# EAGLE schematic Arduino UNO R4 WIFI-Adavanced KIT V1.0 (EAGLE 9.5.1)
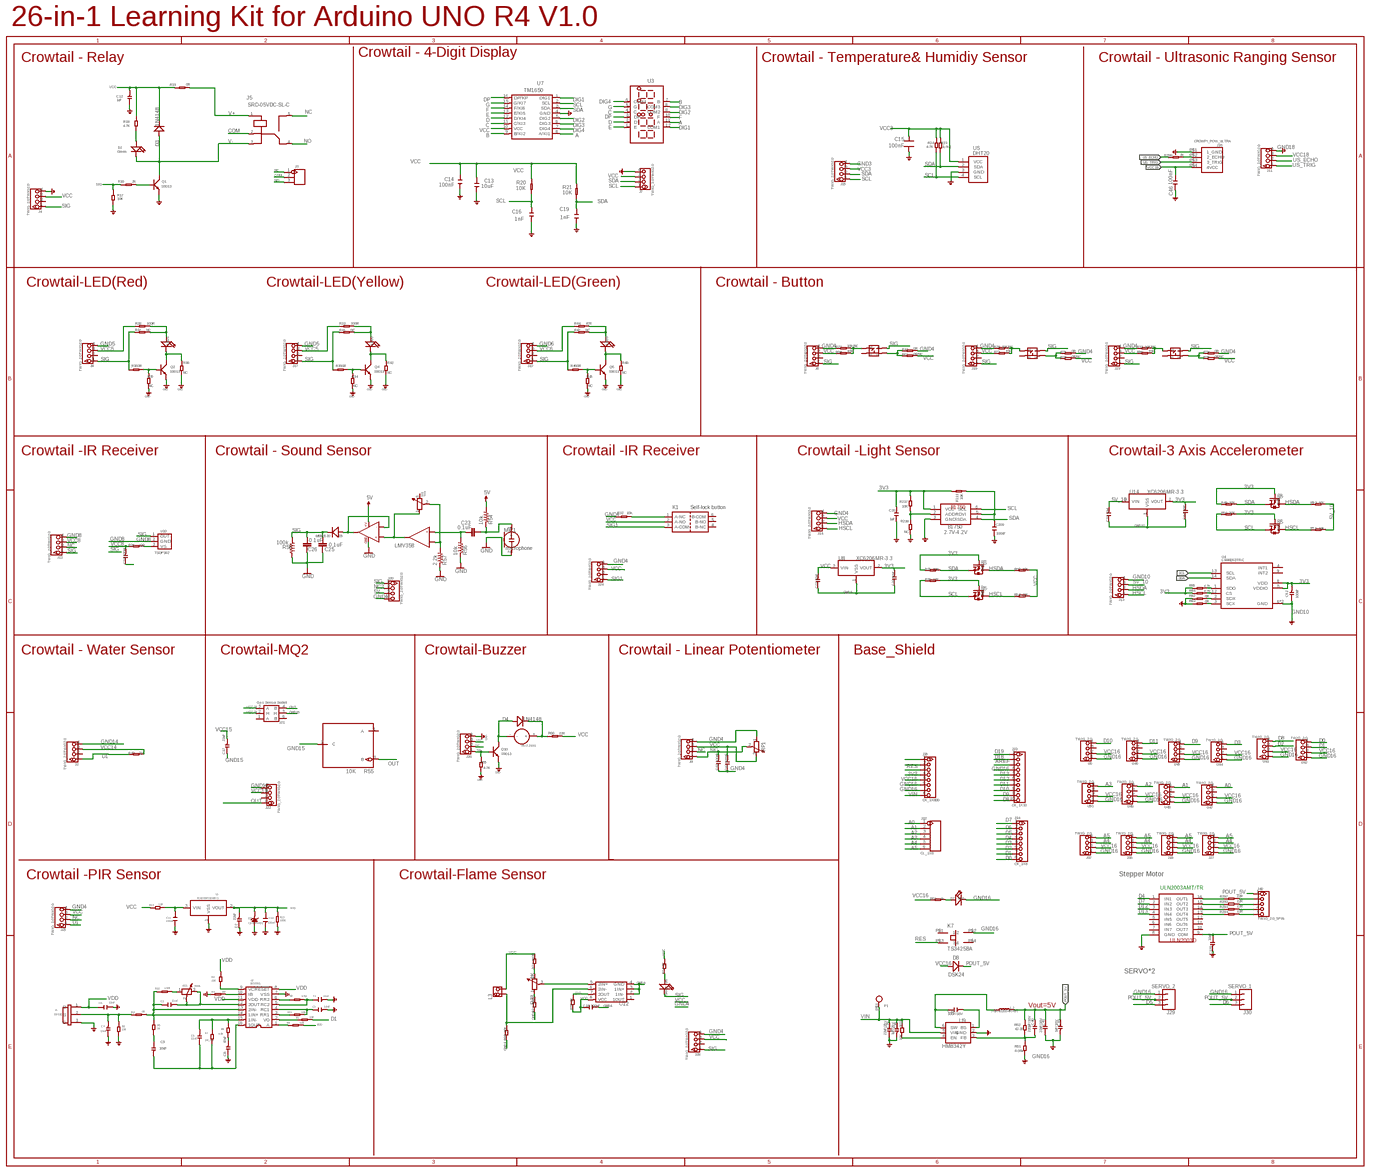
[diagram p0: schematic, sheet 1, overview]
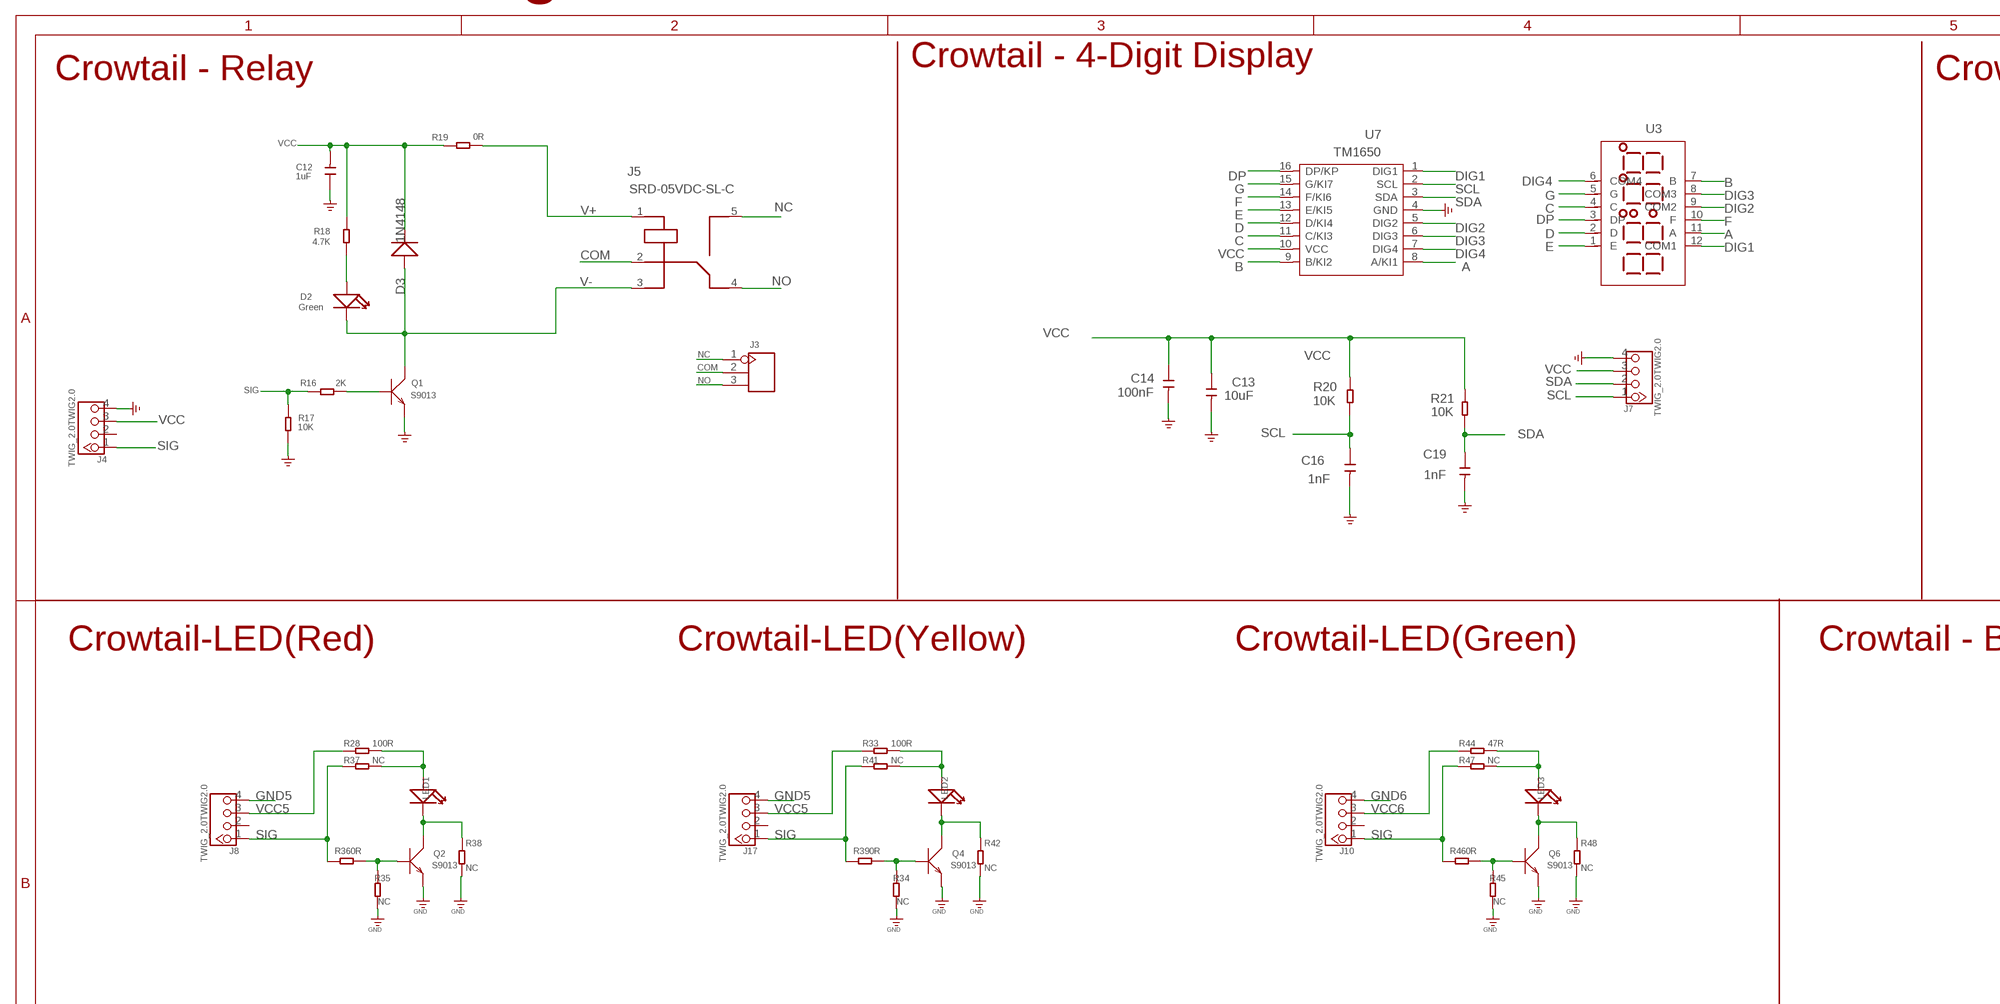
[diagram p1: schematic, sheet 1, part 1 of 4]
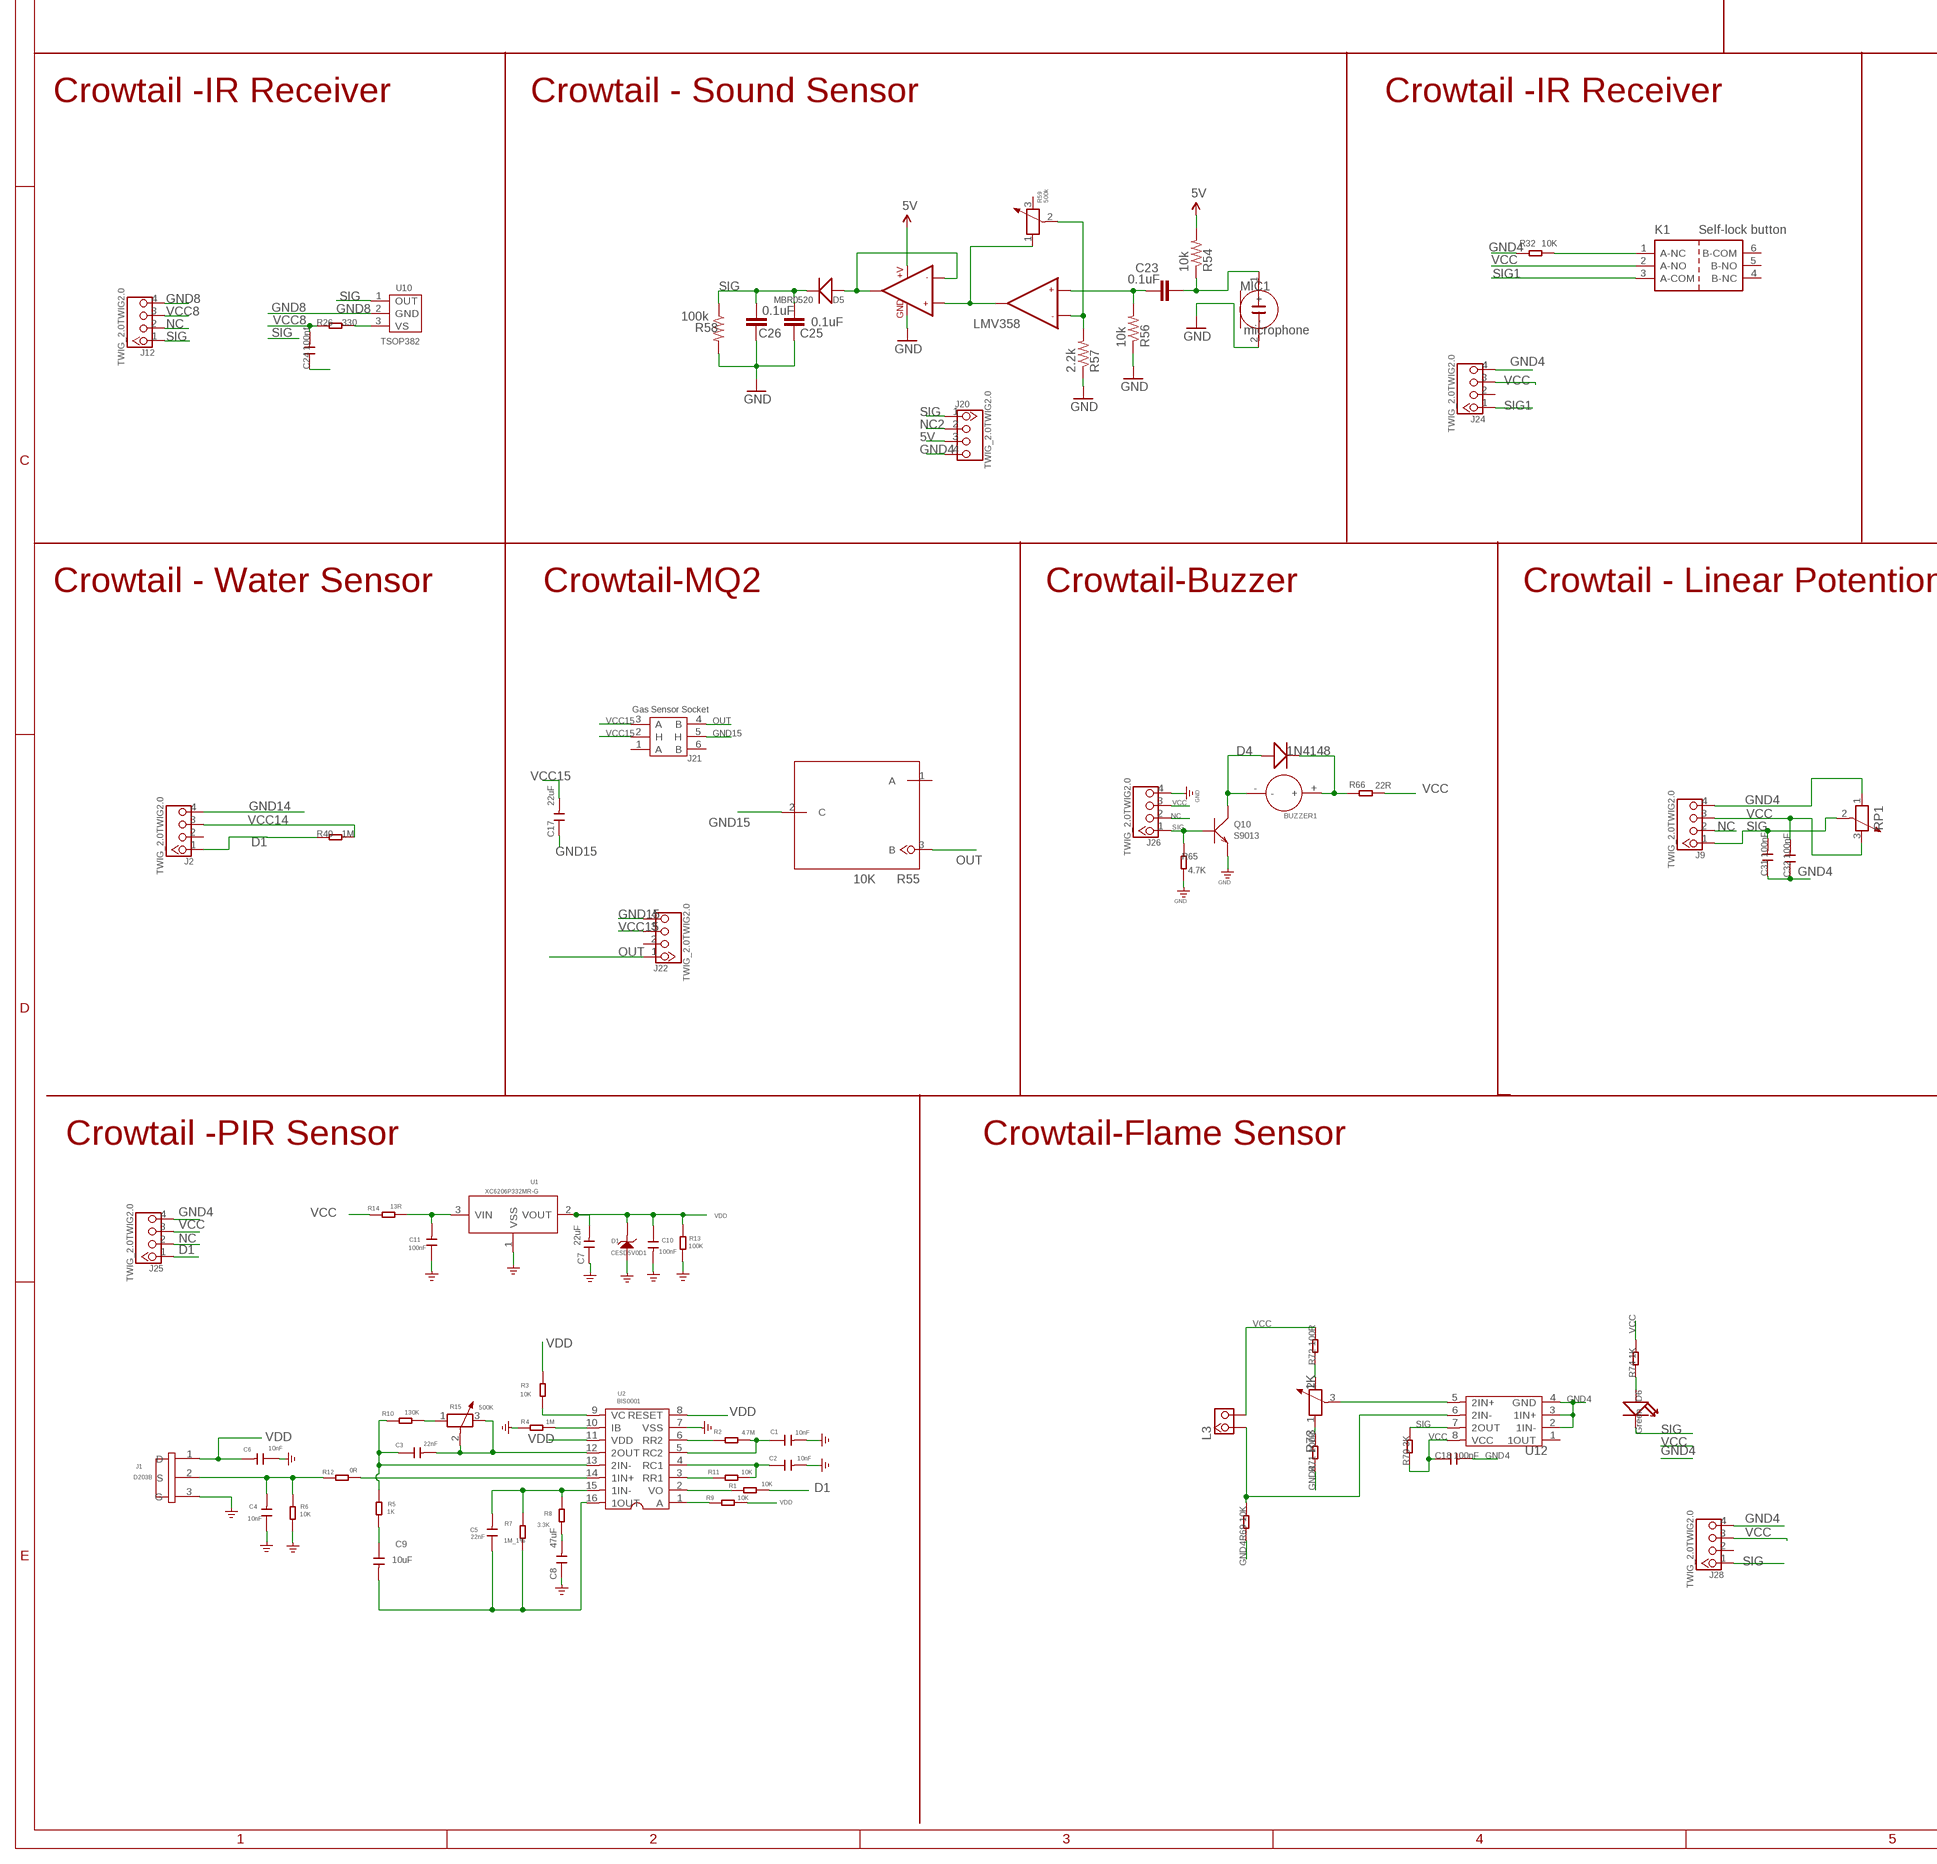
[diagram p2: schematic, sheet 1, part 2 of 4]
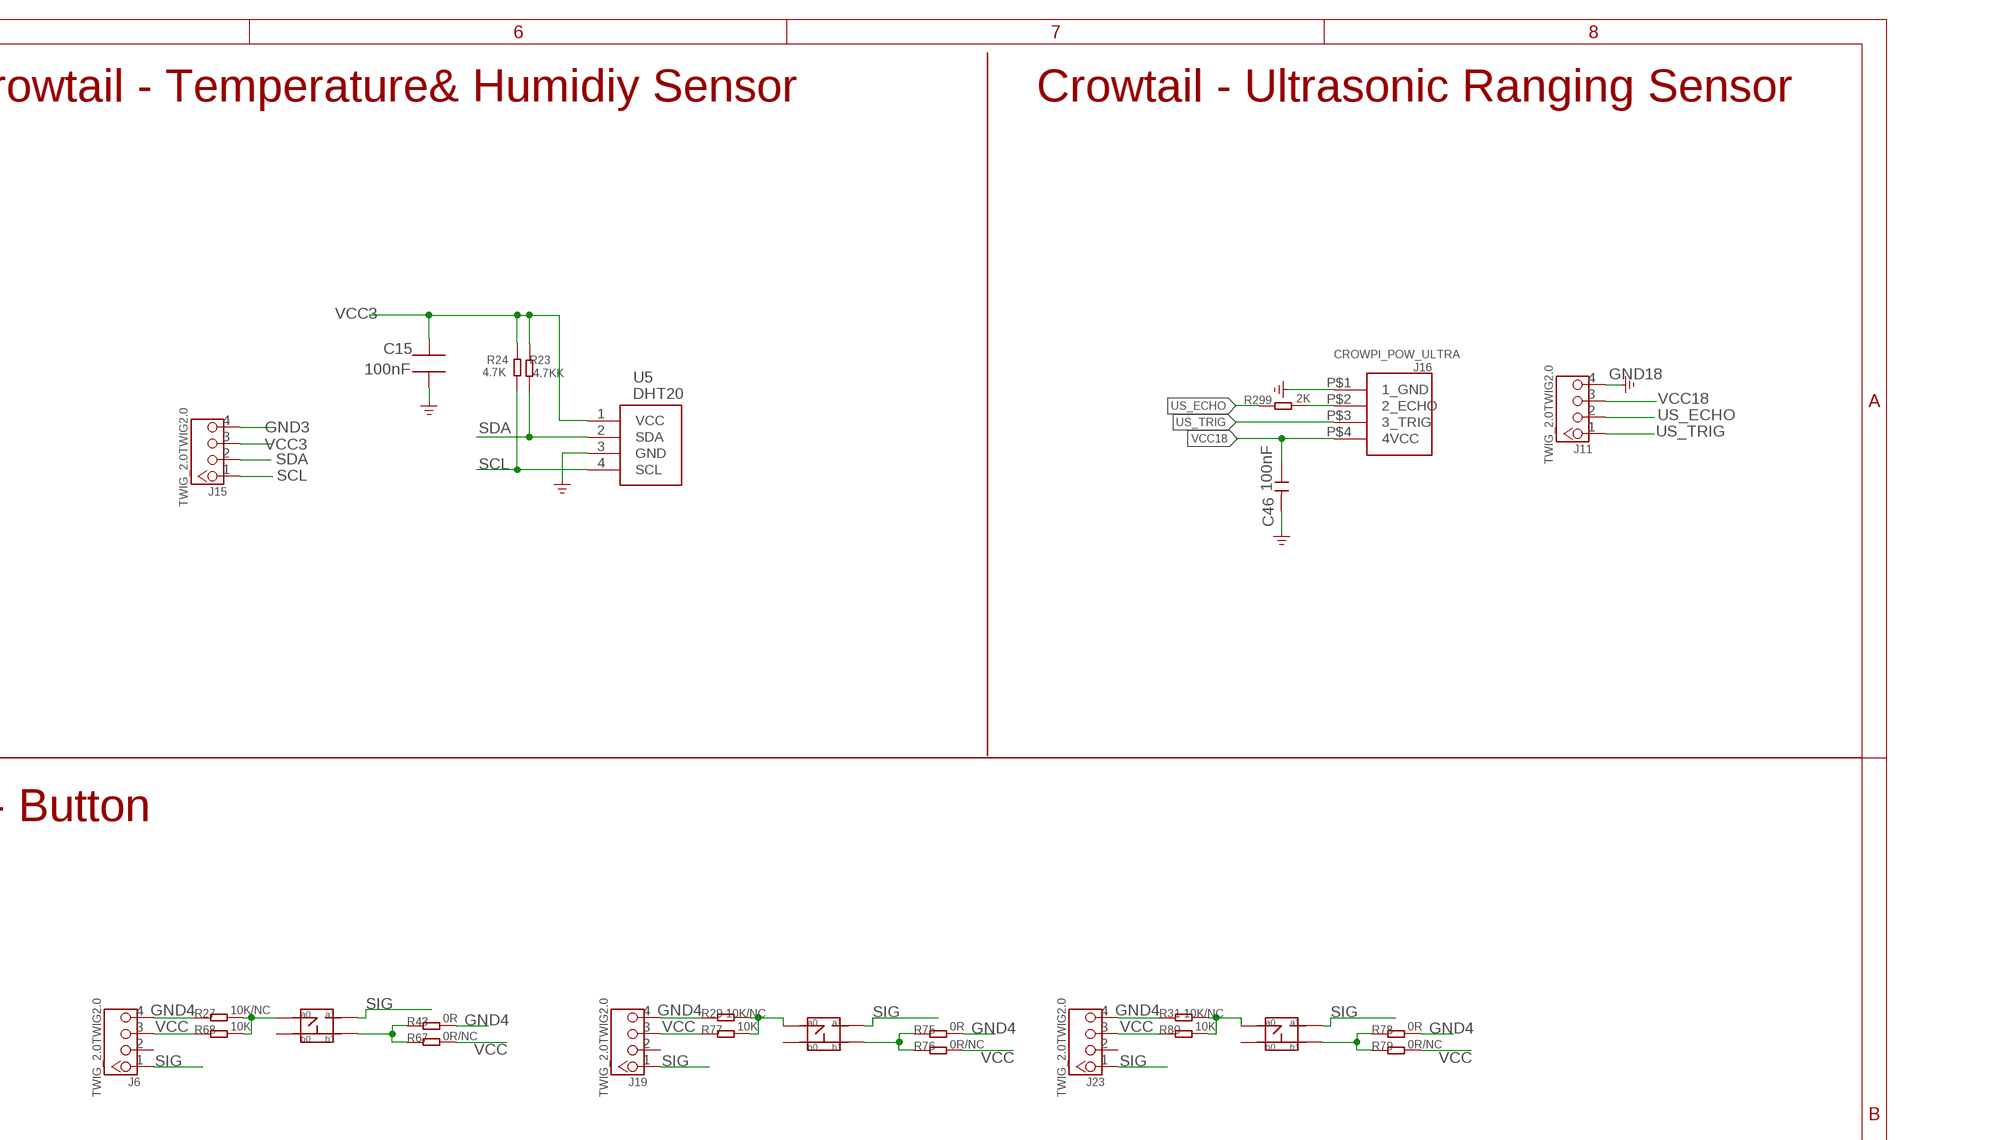
[diagram p3: schematic, sheet 1, part 3 of 4]
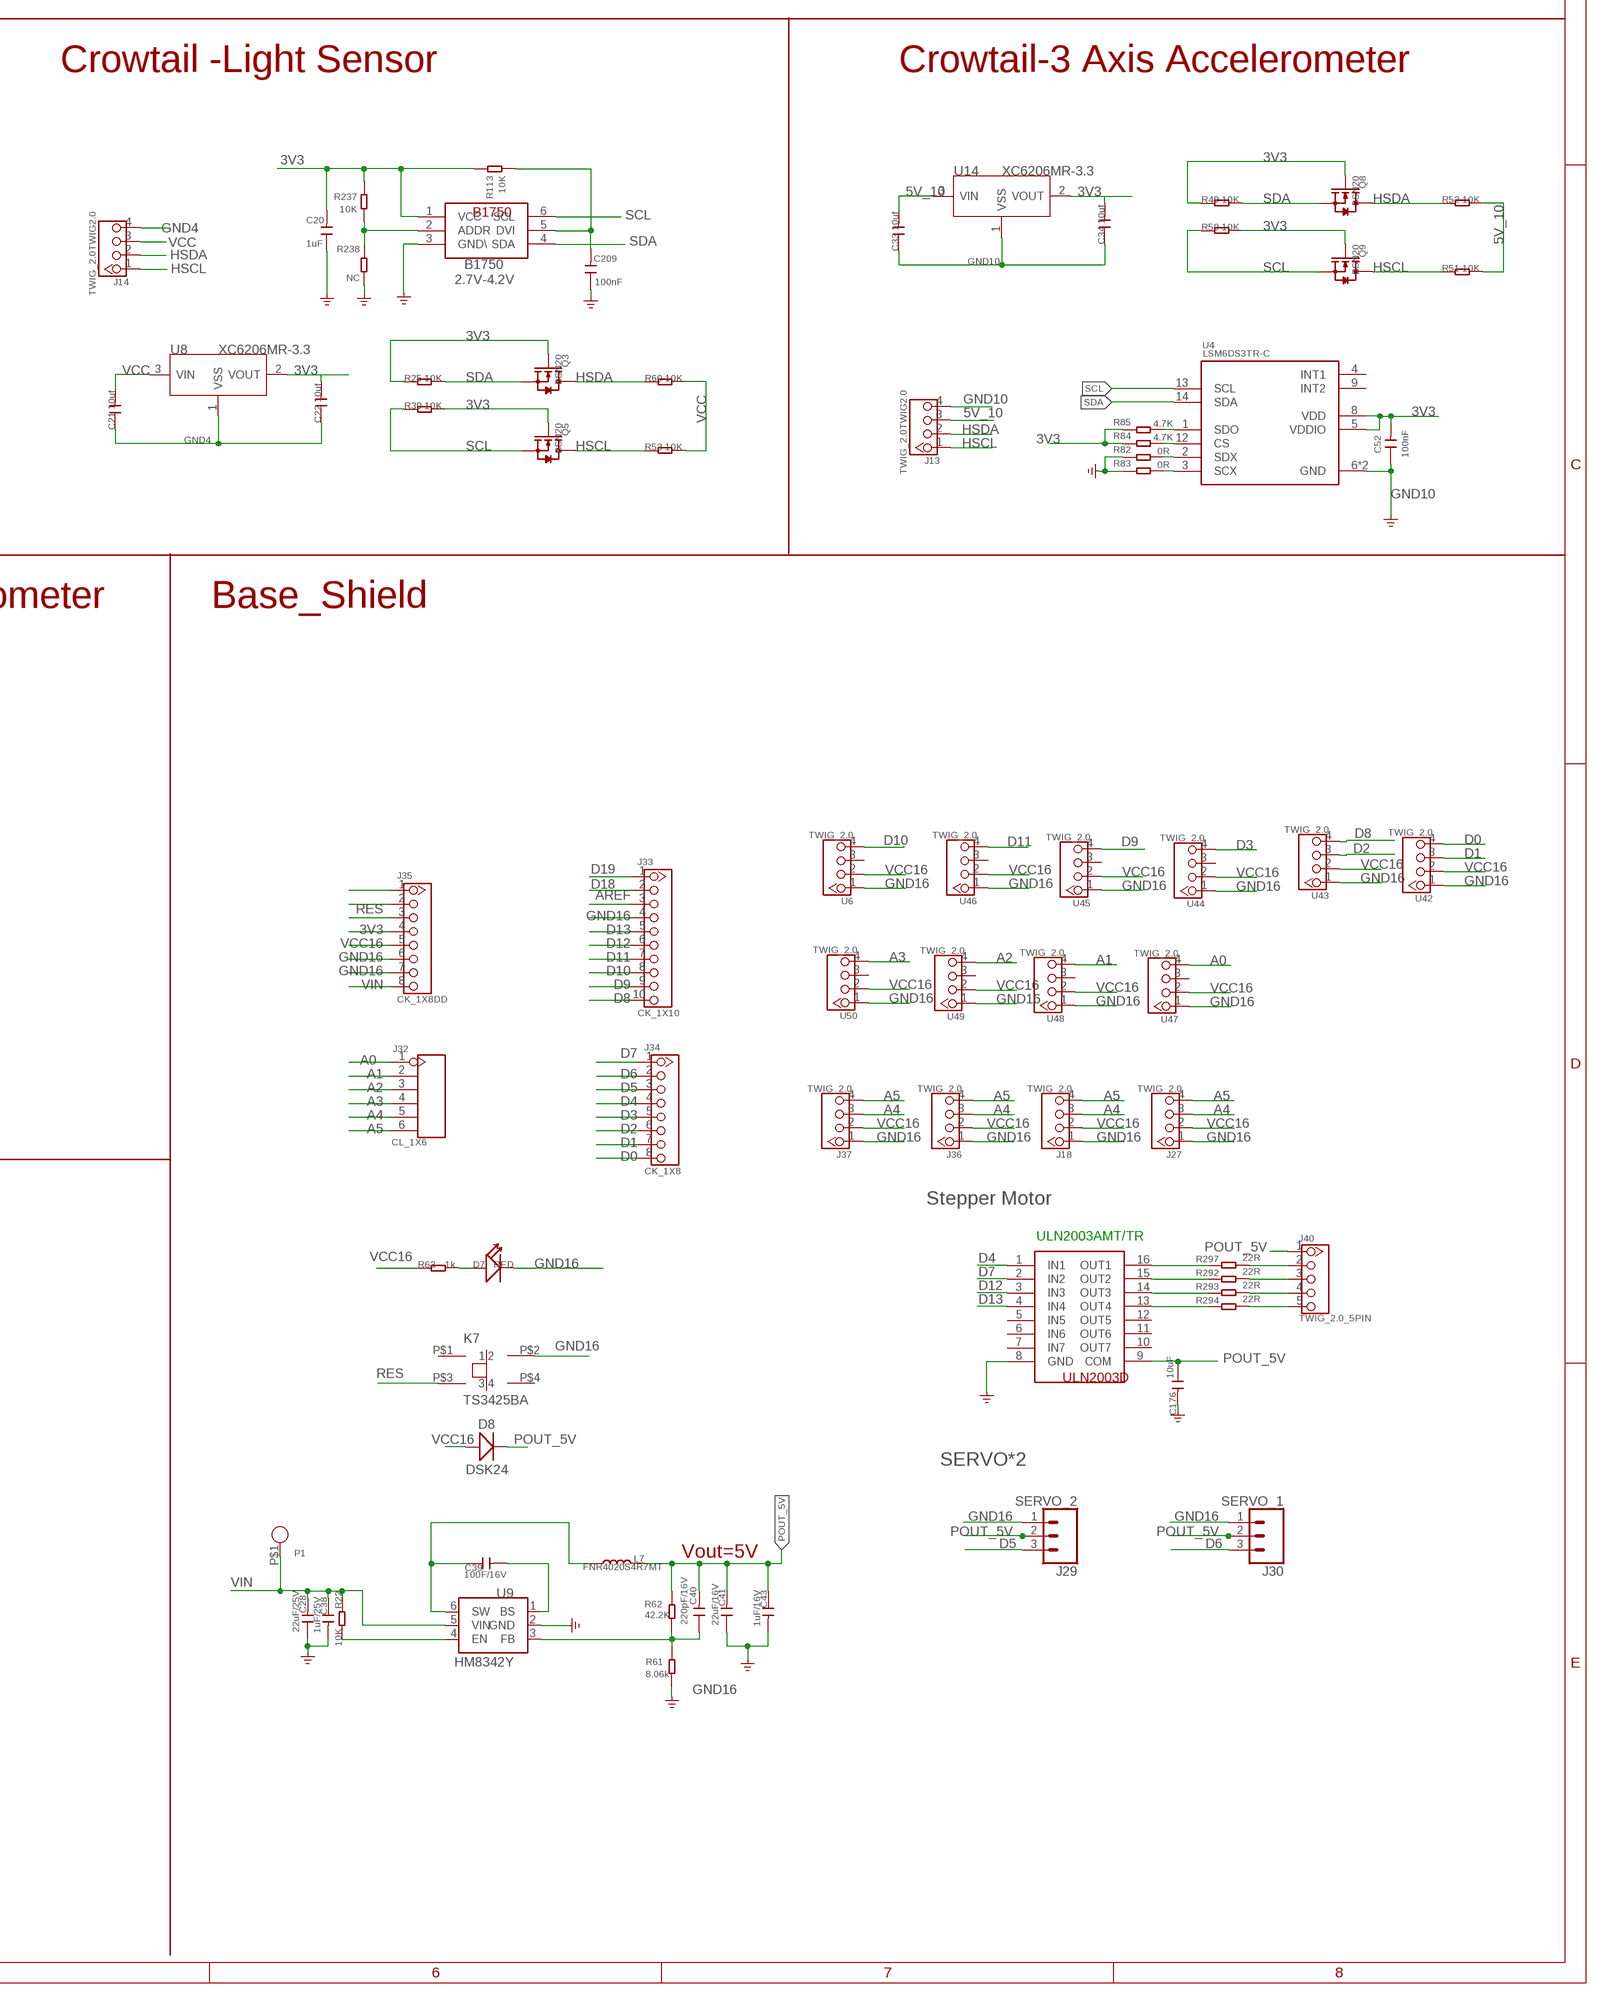
[diagram p4: schematic, sheet 1, part 4 of 4]

## Parts
BUZZER1  BUZZER-YMD12065  [2P-7.6-D12X6.5H]
C1  10nF  C-0603  [C0603]
C2  10nF  C-0603  [C0603]
C3  22nF  C-0603  [C0603]
C4  10nF  C-0603  [C0603]
C5  22nF  C-0603  [C0603]
C6  10nF  C-0603  [C0603]
C7  22uF  CAPC0805  [C0805]
C8  47uF  CAPC0805  [C0805]
C9  10uF  C0603  [0603]
C10  100nF  C-0603  [C0603]
C11  100nF  C-0603  [C0603]
C12  1uF  C0603  [0603]
C13  10uF  C-0603  [C0603]
C14  100nF  C-0603  [C0603]
C15  100nF  C0603  [0603]
C16  1nF  C-0603  [C0603]
C17  22uF  CAPC0805  [C0805]
C18  100nF  C-0603  [C0603]
C19  1nF  C-0603  [C0603]
C20  1uF  CAPC0603  [C0603]
C21  10uf  C-0603  [C0603]
C22  10uf  C-0603  [C0603]
C23  0.1uF  CAP0603-CAP  [0603-CAP]
C24  100nf  C-0603  [C0603]
C25  0.1uF  CAP0603-CAP  [0603-CAP]
C26  0.1uF  CAP0603-CAP  [0603-CAP]
C28  22uF/25V  CAPC0805  [C0805]
C31  100nF  C-0603  [C0603]
C32  100nF  C-0603  [C0603]
C33  10uf  C-0603  [C0603]
C34  10uf  C-0603  [C0603]
C38  1uF/25V  CAPC0603  [C0603]
C39  100F/16V  CAPC0402  [C0402]
C40  220pF/16V  CAPC0402  [C0402]
C41  22uF/16V  CAPC0603  [C0603]
C43  1uF/16V  CAPC0603  [C0603]
C46  100nF  CAPC0603  [C0603]
C52  100nF  C-0603  [C0603]
C176  10uF  CAPC0805  [C0805]
C209  100nF  CAPC0603  [C0603]
D1  CESD5V0D1  D-ESD-2P'CESD5V0D1'  [SOD123-2.7X1.6@1]
D2  Green  LED'0603'  [LED-0603]
D3  1N4148  DIODE1206  [D_SOD123]
D4  1N4148  DIODE1206  [D_SOD123]
D5  MBR0520  D'MBR0520LT1'  [SOD123-2.7X1.6]
D6  Green  LED'0603'  [LED-0603]
D7  RED  LED'0805'  [LED-0805]
D8  DSK24  DIODE  [D_SOD123FL]
J1  D203B  LHI778  [3P-D8.1MM]
J2  TWIG_2.0TWIG2.0  [TWIG_2.0]
J3  SCREW-TERMINAL-3P'5.08'  [3P-5.08]
J4  TWIG_2.0TWIG2.0  [TWIG_2.0]
J5  SRD-05VDC-SL-C  A_XBJ_SMART_PUMP_SONGLE_RELAY  [A_XBJ_SMART_PUMP_SONGLE_RELAY]
J6  TWIG_2.0TWIG2.0  [TWIG_2.0]
J7  TWIG_2.0TWIG2.0  [TWIG_2.0]
J8  TWIG_2.0TWIG2.0  [TWIG_2.0]
J9  TWIG_2.0TWIG2.0  [TWIG_2.0]
J10  TWIG_2.0TWIG2.0  [TWIG_2.0]
J11  TWIG_2.0TWIG2.0  [TWIG_2.0]
J12  TWIG_2.0TWIG2.0  [TWIG_2.0]
J13  TWIG_2.0TWIG2.0  [TWIG_2.0]
J14  TWIG_2.0TWIG2.0  [TWIG_2.0]
J15  TWIG_2.0TWIG2.0  [TWIG_2.0]
J16  CROWPI_POW_ULTRA  [CROWPI_POW_ULTRA]
J17  TWIG_2.0TWIG2.0  [TWIG_2.0]
J18  TWIG_2.0  [2.0_1X4]
J19  TWIG_2.0TWIG2.0  [TWIG_2.0]
J20  TWIG_2.0TWIG2.0  [TWIG_2.0]
J21  Gas Sensor Socket  MQ-SOCKET  [MQ2]
J22  TWIG_2.0TWIG2.0  [TWIG_2.0]
J23  TWIG_2.0TWIG2.0  [TWIG_2.0]
J24  TWIG_2.0TWIG2.0  [TWIG_2.0]
J25  TWIG_2.0TWIG2.0  [TWIG_2.0]
J26  TWIG_2.0TWIG2.0  [TWIG_2.0]
J27  TWIG_2.0  [2.0_1X4]
J28  TWIG_2.0TWIG2.0  [TWIG_2.0]
J29  SERVO_2  CONN_03  [1X03]
J30  SERVO_1  CONN_03  [1X03]
J32  CL_1X6  CK_1X6  [CK_1X6]
J33  CK_1X10  [CK_1X10]
J34  CK_1X8  CK_1X8DD  [CK_1X8]
J35  CK_1X8DD  [CK_1X8]
J36  TWIG_2.0  [2.0_1X4]
J37  TWIG_2.0  [2.0_1X4]
J40  TWIG_2.0_5PIN  [TWIG-2.0-5PIN]
K1  Self-lock button  BUTTON-6P  [6P-2CH-8X8]
K2  12X12  [12X12]
K3  12X12  [12X12]
K4  12X12  [12X12]
K7  TS3425BA  KEY  [SMD_KEY4.2*3.*.2.5]
L3  HEADER_1X2_2.54  [CK_1*2]
L7  FNR4020S4R7MT  LL_4X4  [L_4X4]
LED1  LED-6MM  [LED-2P-2.54-6MM]
LED2  LED-6MM  [LED-2P-2.54-6MM]
LED3  LED-6MM  [LED-2P-2.54-6MM]
MIC1  microphone  MICROPHONE  [2P-D8.9MM]
P1  PADPAD-1.0MM  [PAD-1.0MM]
Q1  S9013  TRANSISTOR-NPN-SOT23  [SOT23@1]
Q2  S9013  TRANSISTOR-NPN-SOT23  [SOT23@1]
Q3  BSN20  MOSFET-N'SOT23'  [SOT23@2]
Q4  S9013  TRANSISTOR-NPN-SOT23  [SOT23@1]
Q5  BSN20  MOSFET-N'SOT23'  [SOT23@2]
Q6  S9013  TRANSISTOR-NPN-SOT23  [SOT23@1]
Q8  BSN20  MOSFET-N'SOT23'  [SOT23@2]
Q9  BSN20  MOSFET-N'SOT23'  [SOT23@2]
Q10  S9013  DISCRETE_TRANSISTOR-NPN-SOT23  [DISCRETE_SOT23]
R1  10K  R-0603  [R0603]
R2  4.7M  R-0603  [R0603]
R3  10K  R-0603  [R0603]
R4  1M  R-0603  [R0603]
R5  1K  R-0603  [R0603]
R6  10K  R-0603  [R0603]
R7  1M_1%  R-0603  [R0603]
R8  3.3K  R-0603  [R0603]
R9  10K  R-0603  [R0603]
R10  130K  R-0603  [R0603]
R11  10K  R-0603  [R0603]
R12  0R  R-0603  [R0603]
R13  100K  R-0603  [R0603]
R14  13R  R-0603  [R0603]
R15  500K  R-POTENTIOMETER-SMD  [3P-SMD-SQUA-3.6X3.3]
R16  2K  R0603  [R0603]
R17  10K  R0603  [R0603]
R18  4.7K  R0603  [R0603]
R19  0R  R0603  [R0603]
R20  10K  R-0603  [R0603]
R21  10K  R-0603  [R0603]
R22  10K  RESR0402  [R0402]
R23  4.7KK  R0603  [0603]
R24  4.7K  R0603  [0603]
R25  10K  R-0603  [R0603]
R26  330  R-0603  [R0603]
R27  10K/NC  R-0603  [R0603]
R28  100R  R-0603  [R0603]
R29  10K/NC  R-0603  [R0603]
R30  10K  R-0603  [R0603]
R31  10K/NC  R-0603  [R0603]
R32  10K  R-0603  [R0603]
R33  100R  R-0603  [R0603]
R34  NC  R-0603  [R0603]
R35  NC  R-0603  [R0603]
R36  0R  R-0603  [R0603]
R37  NC  R-0603  [R0603]
R38  NC  R-0603  [R0603]
R39  0R  R-0603  [R0603]
R40  1M  R0603  [0603]
R41  NC  R-0603  [R0603]
R42  NC  R-0603  [R0603]
R43  0R  R-0603  [R0603]
R44  47R  R-0603  [R0603]
R45  NC  R-0603  [R0603]
R46  0R  R-0603  [R0603]
R47  NC  R-0603  [R0603]
R48  NC  R-0603  [R0603]
R49  10K  R-0603  [R0603]
R50  10K  R-0603  [R0603]
R51  10K  R-0603  [R0603]
R52  10K  R-0603  [R0603]
R53  10K  R-0603  [R0603]
R54  10k  RESISTOR0603-RES  [0603-RES]
R55  10K  DEVICE_RESISTANCE  [PACKAGE__RESISTANCE]
R56  10k  RESISTOR0603-RES  [0603-RES]
R57  2.2k  RESISTOR0603-RES  [0603-RES]
R58  100k  RESISTOR0603-RES  [0603-RES]
R59  500k  R-POTENTIOMETER-SMD  [3P-SMD-SQUA-3.6X3.3]
R60  10K  R-0603  [R0603]
R61  8.06k  RESR0402  [R0402]
R62  42.2K  RESR0402  [R0402]
R63  1k  005-R0603  [0603]
R65  4.7K  R-0603  [R0603]
R66  22R  R-0603  [R0603]
R67  0R/NC  R-0603  [R0603]
R68  10K  R-0603  [R0603]
R69  10K  R-0603  [R0603]
R70  3K  R-0603  [R0603]
R71  100R  R-0603  [R0603]
R72  100R  R-0603  [R0603]
R73  1K  R-POTENTIOMETER'3362'  [3P-SQUA-7X6.8]
R74  1K  R-0603  [R0603]
R75  0R  R-0603  [R0603]
R76  0R/NC  R-0603  [R0603]
R77  10K  R-0603  [R0603]
R78  0R  R-0603  [R0603]
R79  0R/NC  R-0603  [R0603]
R80  10K  R-0603  [R0603]
R82  0R  R0603  [R0603]
R83  0R  R0603  [R0603]
R84  4.7K  R0603  [R0603]
R85  4.7K  R0603  [R0603]
R113  10K  RESR0603  [R0603]
R237  10K  RESR0603  [R0603]
R238  NC  RESR0603  [R0603]
R292  22R  RESR0603  [R0603]
R293  22R  RESR0603  [R0603]
R294  22R  RESR0603  [R0603]
R297  22R  RESR0603  [R0603]
R299  2K  RESR0603  [R0603]
RP1  R-POTENTIOMETER  [3P-SQUA-45.6X10X5.8H]
U1  XC6206P332MR-G  XC6206MR  [SOT23]
U2  BIS0001  TM2291  [SOP16]
U3  MODULE_LED-4BIT-7SEG/CLOCK  [MODULE_7-4-SEG/CLOCK-2.54-32.2*10.2*5.8]
U4  LSM6DS3TR-C  LSM6DS3  [LGA-14L]
U5  DHT20  [DHT20]
U6  TWIG_2.0  [2.0_1X4]
U7  TM1650  [SO16]
U8  XC6206MR-3.3  XC6206MR  [SOT23]
U9  HM8342Y  MT2492-SOT23-6  [SOT23-6L]
U10  TSOP382  [3P-2.54-4.8X5X6.95H]
U11  LMV358  [SO08]
U12  LM293D  [SOIC8-6.0]
U14  XC6206MR-3.3  XC6206MR  [SOT23]
U42  TWIG_2.0  [2.0_1X4]
U43  TWIG_2.0  [2.0_1X4]
U44  TWIG_2.0  [2.0_1X4]
U45  TWIG_2.0  [2.0_1X4]
U46  TWIG_2.0  [2.0_1X4]
U47  TWIG_2.0  [2.0_1X4]
U48  TWIG_2.0  [2.0_1X4]
U49  TWIG_2.0  [2.0_1X4]
U50  TWIG_2.0  [2.0_1X4]
U114  ULN2003AMT/TR  ULN2003DTSSOP-16  [SOP65P640X120-16N]
U121  BH1750  B1750  [B1750]

## Nets
3V3: C20.2 C22.2 C34.2 C52.2 J35.4 Q3.1(G) Q5.1(G) Q8.1(G) Q9.1(G) R25.1 R30.2 R49.1 R50.2 R84.1 R85.1 R113.2 R237.2 U4.5(VDDIO) U4.8(VDD) U8.2(VOUT) U14.2(VOUT) U121.1(VCC)
5V: J20.3 R54.2 U11.8(+V)
5V_10: C33.2 J13.3 R51.2 R52.2 U14.3(VIN)
A: U3.11(A) U7.8(A/KI1)
A0: J32.1 U47.4
A1: J32.2 U48.4
A2: J32.3 U49.4
A3: J32.4 U50.4
A4: J18.3 J27.3 J32.5 J36.3 J37.3
A5: J18.4 J27.4 J32.6 J36.4 J37.4
AREF: J33.3
B: U3.7(B) U7.9(B/KI2)
C: U3.4(C) U7.11(C/KI3)
COM: J3.2 J5.2
D: U3.2(D) U7.12(D/KI4)
D0: J34.8 U42.4
D1: J2.1 J25.1 J34.7 R1.1 R40.1 U42.3
D2: J34.6 U43.3
D3: J34.5 U44.4
D4: J34.4 U114.1(IN1)
D5: J29.3 J34.3
D6: J30.3 J34.2
D7: J34.1 U114.2(IN2)
D8: J33.10 U43.4
D9: J33.9 U45.4
D10: J33.8 U6.4
D11: J33.7 U46.4
D12: J33.6 U114.3(IN3)
D13: J33.5 U114.4(IN4)
D18: J33.2
D19: J33.1
DIG1: U3.12(COM1) U7.1(DIG1)
DIG2: U3.9(COM2) U7.5(DIG2)
DIG3: U3.8(COM3) U7.6(DIG3)
DIG4: U3.6(COM4) U7.7(DIG4)
DP: U3.3(DP) U7.16(DP/KP)
E: U3.1(E) U7.13(E/KI5)
F: U3.10(F) U7.14(F/KI6)
G: U3.5(G) U7.15(G/KI7)
GND3: C15.2 J15.4 U5.3(GND)
GND4: C1.2 C2.2 C4.1 C6.1 C7.1 C8.1 C10.2 C11.1 C12.1 C13.2 C14.2 C16.2 C18.2 C19.2 C20.1 C21.1 C22.1 C25.1 C26.1 C31.1 C32.1 C209.1 D1.1 J1.3(G) J4.4 J6.4 J7.4 J9.4 J14.4 J19.4 J20.4 J23.4 J24.4 J25.4 J26.4 J28.4 MIC1.2(-) Q1.2(E) Q10.2(E) R4.1 R6.1 R13.2 R17.1 R27.1 R29.1 R31.1 R32.1 R43.2 R56.1 R57.1 R58.2 R65.1 R69.1 R71.1 R75.2 R78.2 R238.1 RP1.1 U1.1(VSS) U2.7(VSS) U7.4(GND) U8.1(VSS) U11.4(GND) U12.2(1IN-) U12.3(1IN+) U12.4(GND) U121.3(GND\) ; supply symbol labelled GND
GND5: J8.4 J17.4 Q2.2(E) Q4.2(E) R34.1 R35.1 R38.2 R42.2 ; supply symbol labelled GND
GND6: J10.4 Q6.2(E) R45.1 R48.2 ; supply symbol labelled GND
GND8: C24.1 J12.4 U10.2(GND)
GND10: C33.1 C34.1 C52.1 J13.4 R82.1 R83.1 U4.6(GND) U4.7(GND) U14.1(VSS)
GND14: J2.4
GND15: C17.1 J21.5(H) J22.4 R55.2(C)
GND16: C28.1 C38.2 C41.1 C43.2 C176.2 D7.- J18.1 J27.1 J29.1 J30.1 J33.4 J35.6 J35.7 J36.1 J37.1 K7.P$2 R61.1 U6.1 U9.2(GND) U42.1 U43.1 U44.1 U45.1 U46.1 U47.1 U48.1 U49.1 U50.1 U114.8(GND) ; supply symbol labelled POWER-OR-GND-_GND_POWER
GND18: C46.2 J11.4 J16.P$1(1_GND)
HSCL: J13.1 J14.1 Q5.3(D) Q9.3(D) R51.1 R53.1
HSDA: J13.2 J14.2 Q3.3(D) Q8.3(D) R52.1 R60.1
N$1: R82.2 U4.2(SDX)
N$2: R26.2 U10.3(VS)
N$3: C209.2 R113.1 U121.5(DVI)
N$4: K2.P$1 R27.2 R68.2
N$5: Q1.1(B) R16.2
N$6: D2.+ R18.2
N$8: LED2.+ R33.2 R41.1
N$10: LED1.+ R28.2 R37.1
N$11: LED1.- Q2.3(C) R38.1
N$12: Q2.1(B) R35.2 R36.2
N$13: R297.1 U114.16(OUT1)
N$14: K4.P$1 R31.2 R80.2
N$15: LED2.- Q4.3(C) R42.1
N$16: R11.1 U2.3(RR1)
N$17: LED3.+ R44.2 R47.1
N$18: C2.1 R11.2 U2.4(RC1)
N$19: LED3.- Q6.3(C) R48.1
N$20: Q6.1(B) R45.2 R46.2
N$21: R1.2 U2.2(VO)
N$22: R2.2 U2.6(RR2)
N$23: C1.1 R2.1 U2.5(RC2)
N$24: C3.2 R15.2 R15.3 U2.12(2OUT)
N$25: C3.1 R5.2 R10.2 U2.13(2IN-)
N$26: R3.2 U2.9(VC)
N$27: R4.2 U2.10(IB)
N$28: C4.2 J1.2(S) R6.2 R12.2
N$29: C5.1 C9.2 R7.1 U2.16(1OUT)
N$30: C5.2 R7.2 R8.2 U2.15(1IN-)
N$31: C9.1 R5.1
N$32: C8.2 R8.1
N$33: R9.2 U2.1(A)
N$34: R12.1 U2.14(1IN+)
N$35: C11.2 R14.1 U1.3(VIN)
N$36: R10.1 R15.1
N$37: Q4.1(B) R34.2 R39.2
N$38: K1.1(A-NC) R32.2
N$40: R84.2 U4.12(CS)
N$41: K2.P$3 R43.1 R67.1
N$42: R292.1 U114.15(OUT2)
N$45: C23.1 MIC1.1(+) R54.1
N$46: C23.2 R56.2 U11.5(+IN2)
N$47: R57.2 R59.2 U11.6(-IN2)
N$48: D5.2(+) U11.1(OUT1) U11.2(-IN1)
N$49: R59.1 U11.3(+IN1) U11.7(OUT2)
N$50: R293.1 U114.14(OUT3)
N$51: R294.1 U114.13(OUT4)
N$52: D7.+ R63.2
N$53: BUZZER1.- D4.+ Q10.3(C)
N$54: BUZZER1.+ D4.- R66.1
N$59: R71.2 R73.1
N$60: R83.2 U4.3(SCX)
N$61: R72.1 R73.2
N$62: R73.3 U12.5(2IN+)
N$63: D6.+ R74.1
N$64: L3.1 R69.2 U12.6(2IN-)
N$66: J35.1
N$67: J35.2
N$70: K3.P$1 R29.2 R77.2
N$71: K3.P$3 R75.1 R76.1
N$86: R85.2 U4.1(SDO)
N$258: R237.1 R238.2 U121.2(ADDR)
N$274: J40.2 R297.2
N$275: J40.3 R292.2
N$276: J40.4 R293.2
N$277: J40.5 R294.2
N$278: J16.P$2(2_ECHO) R299.1
N$289: R22.1 U9.4(EN)
N$290: C39.1 L7.1 U9.6(SW)
N$291: C39.2 U9.1(BS)
N$292: C40.1 R61.2 R62.1 U9.3(FB)
N$294: K4.P$3 R78.1 R79.1
NC: J3.1 J5.5 J9.2 J12.2 J25.2 J26.2
NC2: J20.2
NO: J3.3 J5.4
OUT: J21.4(B) J22.1 R55.3(B)
POUT_5V: C40.2 C41.2 C43.1 C176.1 D8.- J29.2 J30.2 J40.1 L7.2 R62.2 U114.9(COM)
RES: J35.3 K7.P$3
SCL: C16.1 J7.1 J15.1 Q5.2(S) Q9.2(S) R20.2 R24.1 R30.1 R50.1 U4.13(SCL) U5.4(SCL) U7.2(SCL) U121.6(SCL)
SDA: C19.1 J7.2 J15.2 Q3.2(S) Q8.2(S) R21.2 R23.1 R25.2 R49.2 U4.14(SDA) U5.2(SDA) U7.3(SDA) U121.4(SDA)
SIG: C25.2 C26.2 C31.2 D5.1(-) D6.- J4.1 J6.1 J8.1 J9.1 J10.1 J12.1 J17.1 J19.1 J20.1 J23.1 J26.1 J28.1 K2.P$2 K3.P$2 K4.P$2 Q10.1(B) R16.1 R17.2 R36.1 R37.2 R39.1 R41.2 R46.1 R47.2 R58.1 R65.2 R70.2 RP1.2 U10.1(OUT) U12.7(2OUT)
SIG1: J24.1 K1.3(A-COM)
US_ECHO: J11.2 R299.2
US_TRIG: J11.1 J16.P$3(3_TRIG)
V+: J5.1 R19.2
V-: D2.- D3.+ J5.3 Q1.3(C)
VCC: C12.2 C13.1 C14.1 C18.1 C21.2 C32.2 D3.- J4.3 J6.3 J7.3 J9.3 J14.3 J19.3 J23.3 J24.3 J25.3 J26.3 J28.3 K1.2(A-NO) L3.2 R14.2 R18.1 R19.1 R20.1 R21.1 R53.2 R60.2 R66.2 R67.2 R68.1 R70.1 R72.2 R74.2 R76.2 R77.1 R79.2 R80.1 RP1.3 U7.10(VCC) U8.3(VIN) U12.8(VCC)
VCC3: C15.1 J15.3 R23.2 R24.2 U5.1(VCC)
VCC5: J8.3 J17.3 R28.1 R33.1
VCC6: J10.3 R44.1
VCC8: C24.2 J12.3 R26.1
VCC14: J2.3 R40.2
VCC15: C17.2 J21.2(H) J21.3(A) J22.3
VCC16: D8.+ J18.2 J27.2 J35.5 J36.2 J37.2 R63.1 U6.2 U42.2 U43.2 U44.2 U45.2 U46.2 U47.2 U48.2 U49.2 U50.2
VCC18 [PWR]: C46.1 J11.3 J16.P$4(4VCC)
VDD: C6.2 C7.2 C10.1 D1.2 J1.1(D) R3.1 R9.1 R13.1 U1.2(VOUT) U2.8(!RESET) U2.11(VDD)
VIN: C28.2 C38.1 J35.8 P1.P$1 R22.2 U9.5(VIN)
Unconnected: J2.2 J4.2 J6.2 J8.2 J10.2 J17.2 J19.2 J21.1(A) J21.6(B) J22.2 J23.2 J24.2 J28.2 K1.4(B-NC) K1.5(B-NO) K1.6(B-COM) K2.P$4 K3.P$4 K4.P$4 K7.P$1 K7.P$4 R55.1(A) R59.3 U4.4(INT1) U4.9(INT2) U6.3 U12.1(1OUT) U44.3 U45.3 U46.3 U47.3 U48.3 U49.3 U50.3 U114.5(IN5) U114.6(IN6) U114.7(IN7) U114.10(OUT7) U114.11(OUT6) U114.12(OUT5)

## Notes on the sheet
- 26-in-1 Learning Kit for Arduino UNO R4 V1.0
- Crowtail - 4-Digit Display
- Crowtail - Relay | Crowtail - Temperature& Humidiy Sensor | Crowtail - Ultrasonic Ranging Sensor
- Crowtail-LED(Red) | Crowtail-LED(Yellow) | Crowtail-LED(Green) | Crowtail - Button
- Crowtail -IR Receiver | Crowtail - Sound Sensor | Crowtail -IR Receiver | Crowtail -Light Sensor | Crowtail-3 Axis Accelerometer
- 2.7V-4.2V
- LMV358
- Crowtail - Water Sensor | Crowtail-MQ2 | Crowtail-Buzzer | Crowtail - Linear Potentiometer | Base_Shield
- Stepper Motor
- Crowtail -PIR Sensor | Crowtail-Flame Sensor
- ULN2003AMT/TR
- SERVO*2
- Vout=5V

## Library data of the parts
BUZZER1 = template:BUZZER-YMD12065
C1-C6 C10 C11 C13 C14 C16 C18 C19 C21 C22 C24 C31-C34 C52 = Discrete:C*: Ceramic Capacitors
C7 C8 C17 = LoraWAN_Gateway_Mainboard:CAP*
C9 C12 = A_xbj:C0603
C15 = CPT_SMD:C0603; C0603: 100N
C20 C28 C38-C41 C43 C46 C176 C209 = Brian:CAP*
C23 C25 C26 = SparkFun:CAP: Capacitor Standard 0603 ceramic capacitor, and 0.1" leaded capacitor.
D1 = Discrete:D-ESD-2P: Diodes for Protectiong against ESD
D2 D6 LED1-LED3 = Discrete:LED*
D3 D4 = Crowtail_Starter:DIODE*
D5 = Discrete:D*
D7 = brain1:LED*
D8 = brain1:DIODE*
J1 = PIR_motion_sensor:LHI778: Pyroelectric Infrared Detectors
J2 J4 J6-J15 J17 J19 J20 J22-J26 J28 = brain1:TWIG_2.0
J3 = Connector:SCREW-TERMINAL-3P
J5 = Crowtail-Relay-V2.0-20191204-01:A_XBJ_SMART_PUMP_SONGLE_RELAY
J16 = Crowtail_Starter_V0.2:CROWPI_POW_ULTRA
J18 J27 J36 J37 U6 U42-U50 = CONNECTER:TWIG_2.0
J21 = Brian:MQ-SOCKET
J29 J30 = SparkFun-Connectors:CONN_03: Multi connection point. Often used as Generic Header-pin footprint for 0.1 inch spaced/style header connections On any of the 0.1 inch spaced packages, you can populate with these: Break Away Headers - Straight (PRT-00116) Break Away Male Headers - Right Angle (PRT-00553) Female Headers (PRT-00115) Break Away Headers - Machine Pin (PRT-00117) Break Away Female Headers - Swiss Machine Pin (PRT-00743) Stackable Header - 3 Pin (Female, 0.1") (PRT-13875) For SCREWTERMINALS and SPRING TERMINALS visit here: Screw Terimnals on SparkFun.com (5mm/3.5mm/2.54mm spacing) This device is also useful as a general connection point to wire up your design to another part of your project. Our various solder wires solder well into these plated through hole pads. Hook-Up Wire - Assortment (Stranded, 22 AWG) (PRT-11375) Hook-Up Wire - Assortment (Solid Core, 22 AWG) (PRT-11367) View the entire wire category on our website here Special notes: Molex polarized connector foot print use with SKU : PRT-08232 with associated crimp pins and housings.; PROD_ID: XXX-00000; VALUE: 455-1750-1-ND
J32 = CONNECTER:CK_1X6
J33 = brain1:CK_1X10
J34 J35 = CONNECTER:CK_1X8
J40 = brain1:TWIG_2.0_5PIN
K1 = Discrete:BUTTON-6P
K2-K4 = smart pump:12X12
K7 = CKP:KEY
L3 = CONNECTER:HEADER_1X2
L7 = Brian:L*
MIC1 = template:MICROPHONE
P1 = brain1:PAD*
Q1 Q2 Q4 Q6 = Discrete:TRANSISTOR-NPN*: NPN audion
Q3 Q5 Q8 Q9 = Discrete:MOSFET-N: IRLL014: http://www.vishay.com/docs/91319/sihll014.pdf
Q10 = A_xbj:DISCRETE_TRANSISTOR-NPN*: NPN audion
R1-R14 R20 R21 R25-R39 R41-R53 R60 R65-R72 R74-R80 = Discrete:R*
R15 R59 R73 RP1 = Discrete:R-POTENTIOMETER*: Potentiometer
R16-R19 = A_xbj:R0603
R22 R61 R62 R113 R237 R238 R292-R294 R297 R299 = Brian:RES*
R23 R24 R40 = CPT_SMD:R0603
R54 R56-R58 = SparkFun:RESISTOR: Resistor Basic schematic elements and footprints for 0603, 1206, and PTH resistors.
R55 = test:DEVICE_RESISTANCE
R63 = Discrete:005-R*
R82-R85 = cooper:R0603
U1 U8 U14 = IC:XC6206: LOW ESR Cap.Compatible Positive Voltage Regulators
U2 = PIR_motion_sensor:TM2291: Infrared signal processor
U3 = A_xbj:MODULE_LED-4BIT-7SEG/CLOCK
U4 = Brian:LSM6DS3
U5 = Crowtail-DHT20-V1.0-20211013:DHT20
U7 = IC:TM1650
U9 = LoraWAN_Gateway_Mainboard:MT2492-SOT23-6
U10 = IC:TSOP382: IR Receiver Modules for Remote Control Systems
U11 = SparkFun:LMV358
U12 = IC:LM293: Dual Differential Comparator
U114 = brain1:ULN2003D
U121 = b1750:B1750; B1750: B1750

## Net classes
1 PWR: width 0.305 mm
2 gnd: width 0.152 mm, drill 0.3 mm, clearance 0.152 mm